# Altium schematic sheet DAC.SchDoc: DAC
size A4; DocumentNumber: 8; Revision: 2.0; SheetNumber: 8; SheetTotal: 18
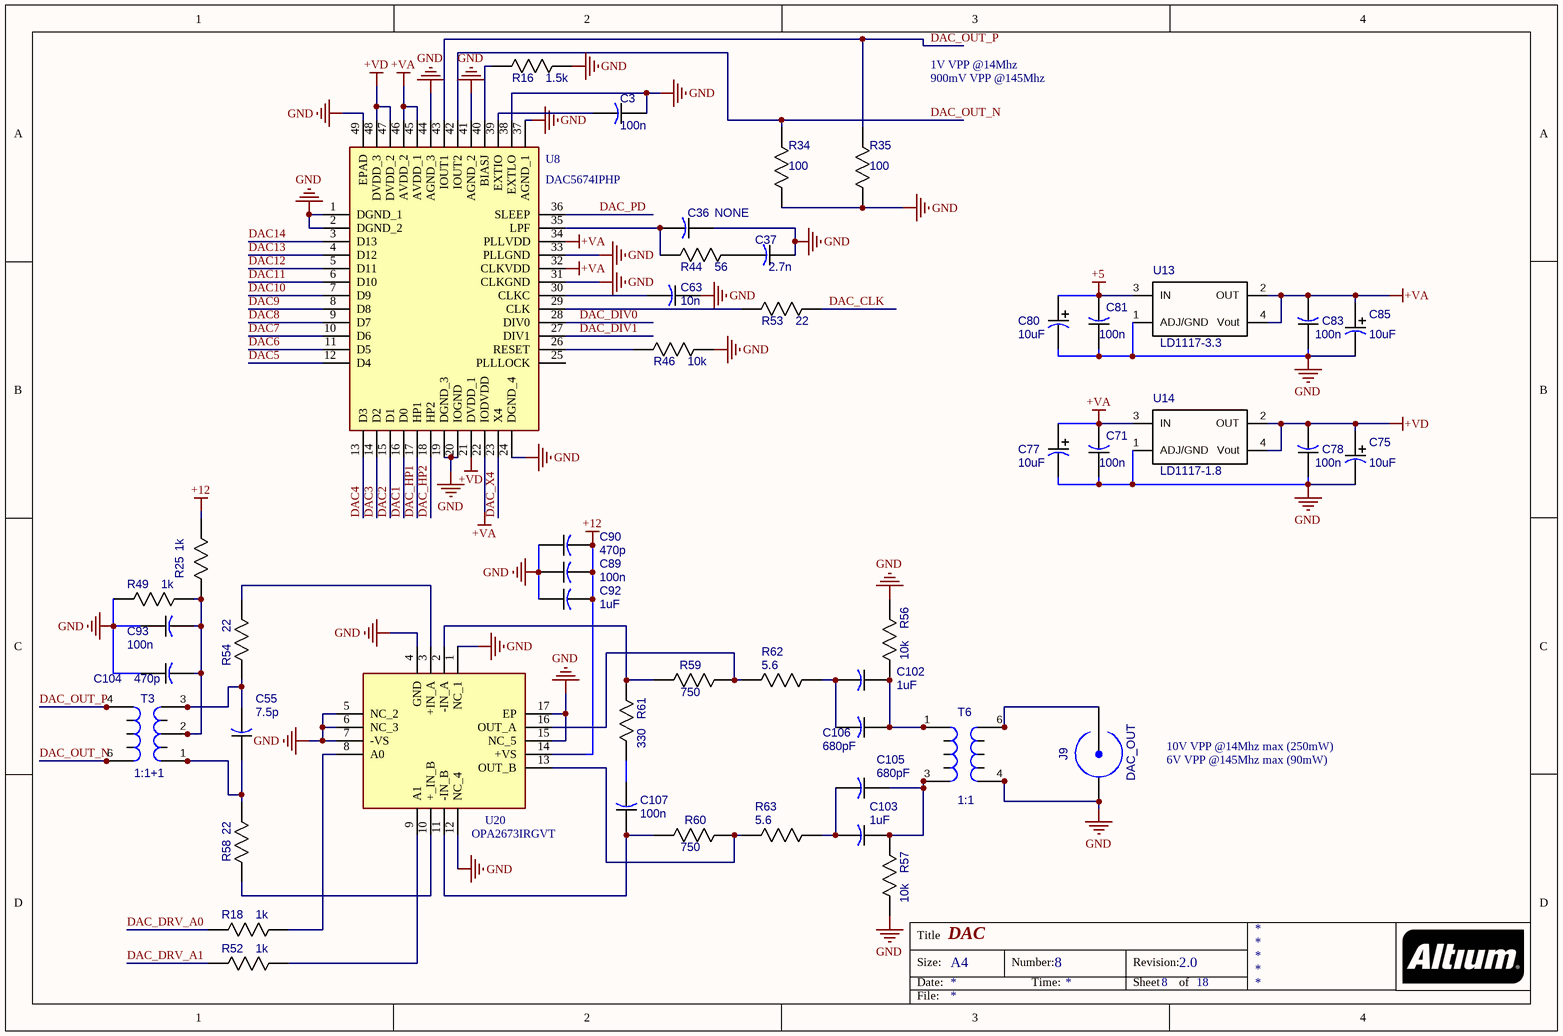
[diagram p0: DAC.SchDoc]

## Parts
C3  100n  [CAP_0805]
C36  NONE  [CAP_0805]
C37  2.7n  [CAP_0805]
C55  7.5p  [CAP_0805]
C63  10n  [CAP_0805]
C71  100n  [CAP_0805]
C75  10uF  [EEEFC_sizeB]
C77  10uF  [EEEFC_sizeB]
C78  100n  [CAP_0805]
C80  10uF  [EEEFC_sizeB]
C81  100n  [CAP_0805]
C83  100n  [CAP_0805]
C85  10uF  [EEEFC_sizeB]
C89  100n  [CAP_0805]
C90  470p  [CAP_0805]
C92  1uF  [CAP_0805]
C93  100n  [CAP_0805]
C102  1uF  [CAP_1206]
C103  1uF  [CAP_1206]
C104  470p  [CAP_0805]
C105  680pF  [CAP_1206]
C106  680pF  [CAP_1206]
C107  100n  [CAP_0805]
J9  DAC_OUT  [31-5431]
R16  1.5k  [RES_0805]
R18  1k  [RES_0805]
R25  1k  [RES_0805]
R34  100  [RES_0805]
R35  100  [RES_0805]
R44  56  [RES_0805]
R46  10k  [RES_0805]
R49  1k  [RES_0805]
R52  1k  [RES_0805]
R53  22  [RES_0805]
R54  22  [RES_0805]
R56  10k  [RES_0805]
R57  10k  [RES_0805]
R58  22  [RES_0805]
R59  750  [RES_0805]
R60  750  [RES_0805]
R61  330  [RES_0805]
R62  5.6  [RES_1206]
R63  5.6  [RES_1206]
T3  1:1+1  [TRANSF_ACORE2]
T6  1:1  [TRANSF_ACORE]
U8  DAC5674IPHP  [QFP50P900X900X100-49N]
U13  LD1117-3.3  [LT1117CST-3.3]
U14  LD1117-1.8  [LT1117CST-3.3]
U20  OPA2673IRGVT  [QFN65P400X400X100-17N-D]

## Nets
+5: C80.1(PLUS) C81.2 U13.3(IN)
+12: C89.2 C90.2 C92.2 R25.2 U20.14(+VS)
+VA: C71.2 C77.1(PLUS) C83.2 C85.1(PLUS) U8.22(IODVDD) U8.32(CLKVDD) U8.34(PLLVDD) U8.45(AVDD_1) U8.46(AVDD_2) U13.2(OUT) U13.4(Vout) U14.3(IN)
+VD: C75.1(PLUS) C78.2 U8.21(DVDD_1) U8.47(DVDD_2) U8.48(DVDD_3) U14.2(OUT) U14.4(Vout)
GND: C3.1 C36.1 C37.1 C63.1 C71.1 C75.2(MINUS) C77.2(MINUS) C78.1 C80.2(MINUS) C81.1 C83.1 C85.2(MINUS) C89.1 C90.1 C92.1 C93.1 C104.1 J9.1(GND) J9.2(GND) J9.3(GND) J9.4(GND) R16.1 R34.1 R35.1 R46.1 R49.2 R56.1 R57.2 T6.4(S2) T6.11 U8.1(DGND_1) U8.2(DGND_2) U8.19(DGND_3) U8.20(IOGND) U8.24(DGND_4) U8.31(CLKGND) U8.33(PLLGND) U8.37(AGND_1) U8.38(EXTLO) U8.41(AGND_2) U8.44(AGND_3) U8.49(EPAD) U13.1(ADJ/GND) U14.1(ADJ/GND) U20.1(NC_1) U20.4(GND) U20.5(NC_2) U20.6(NC_3) U20.7(-VS) U20.12(NC_4) U20.15(NC_5) U20.17(EP)
DAC1: U8.16(D0)
DAC2: U8.15(D1)
DAC3: U8.14(D2)
DAC4: U8.13(D3)
DAC5: U8.12(D4)
DAC6: U8.11(D5)
DAC7: U8.10(D6)
DAC8: U8.9(D7)
DAC9: U8.8(D8)
DAC10: U8.7(D9)
DAC11: U8.6(D10)
DAC12: U8.5(D11)
DAC13: U8.4(D12)
DAC14: U8.3(D13)
DAC_CLK: R53.1
DAC_DIV0: U8.28(DIV0)
DAC_DIV1: U8.27(DIV1)
DAC_DRV_A0: R18.1
DAC_DRV_A1: R52.1
DAC_HP1: U8.17(HP1)
DAC_HP2: U8.18(HP2)
DAC_OUT_N: R34.2 T3.6(P2) T3.10 U8.42(IOUT2)
DAC_OUT_P: R35.2 T3.4(P1) T3.11 U8.43(IOUT1)
DAC_PD: U8.36(SLEEP)
DAC_X4: U8.23(X4)
NetC3_2: C3.2 U8.39(EXTIO)
NetC36_2: C36.2 R44.2 U8.35(LPF)
NetC37_2: C37.2 R44.1
NetC55_1: C55.1 R58.2 T3.1(S3) T3.7
NetC55_2: C55.2 R54.1 T3.3(S1) T3.9
NetC63_2: C63.2 U8.30(CLKC)
NetC93_2: C93.2 C104.2 R25.1 R49.1 T3.2(S2) T3.8
NetC102_1: C102.1 C106.1 R56.2 T6.1(P1) T6.7
NetC102_2: C102.2 C106.2 R62.1
NetC103_1: C103.1 C105.1 R57.1 T6.3(P2) T6.9
NetC103_2: C103.2 C105.2 R63.1
NetC107_1: C107.1 R60.2 U20.11(-IN_B)
NetC107_2: C107.2 R61.2
NetJ9_5: J9.5(CON) T6.6(S1) T6.10
NetR16_2: R16.2 U8.40(BIASJ)
NetR18_2: R18.2 U20.8(A0)
NetR46_2: R46.2 U8.26(RESET)
NetR52_2: R52.2 U20.9(A1)
NetR53_2: R53.2 U8.29(CLK)
NetR54_2: R54.2 U20.3(+IN_A)
NetR58_1: R58.1 U20.10(+_IN_B)
NetR59_1: R59.1 R62.2 U20.16(OUT_A)
NetR59_2: R59.2 R61.1 U20.2(-IN_A)
NetR60_1: R60.1 R63.2 U20.13(OUT_B)

Not connected (* = marked no-connect by the designer): T6 8(0); U8 25(PLLLOCK)

## Notes on the sheet
- 1V VPP @14Mhz
- 900mV VPP @145Mhz
- 10V VPP @14Mhz max (250mW)
- 6V VPP @145Mhz max (90mW)
- Title
- Size:
- Date:
- A4
- Number:
- Time:
- Revision:
- Sheet
- of
- File:

## Library data of the parts
C3 C36 C37 C55 C63 C71 C78 C81 C83 C89 C90 C92 C93 C104 C107 = CAP_0805
  C71 C78 C81 C83 C89 C93 C107: Value: 100n
  C90 C104: Value: 470p
  C92: Value: 1uF
C75 C77 C80 C85 = EEEFC_sizeB
  C77 C80: Value: 10uF
C102 C103 C105 C106 = CAP_1206
  C102 C103: Value: 1uF
  C105 C106: Value: 680pF
J9 = 31-5431: SMA; Value: DAC_OUT
R16 R18 R25 R34 R35 R44 R46 R49 R52-R54 R56-R61 = RES_0805
  R25 R49: Value: 1k
  R54 R58: Value: 22
  R56 R57: Value: 10k
  R61: Value: 330
R62 R63 = RES_1206: Value: 5.6
T3 = TRANSF_ACORE2: Transformer; Value: 1:1+1
T6 = TRANSF_ACORE: Transformer; Value: 1:1
U8 = DAC5674IPHP: Integrated Circuit; Manufacturer_Name: Texas Instruments; Datasheet Link: https://www.ti.com/lit/ds/symlink/dac5674.pdf; Height: 1mm; Manufacturer_Part_Number: DAC5674IPHP
U13 = LT1117CST-3.3: Value: LD1117-3.3
U14 = LT1117CST-3.3: LT1117CST-1.8; Value: LD1117-1.8
U20 = OPA2673IRGVT: Integrated Circuit; Manufacturer_Name: Texas Instruments; Datasheet Link: http://www.ti.com/lit/gpn/opa2673; Height: 1mm; Manufacturer_Part_Number: OPA2673IRGVT; Mouser Part Number: 595-OPA2673IRGVT; Mouser Price/Stock: https://www.mouser.co.uk/ProductDetail/Texas-Instruments/OPA2673IRGVT?qs=xHCJPbHdANbeLKV0FJjs6g%3D%3D; RS Part Number: 8122587P; RS Price/Stock: http://uk.rs-online.com/web/p/products/8122587P